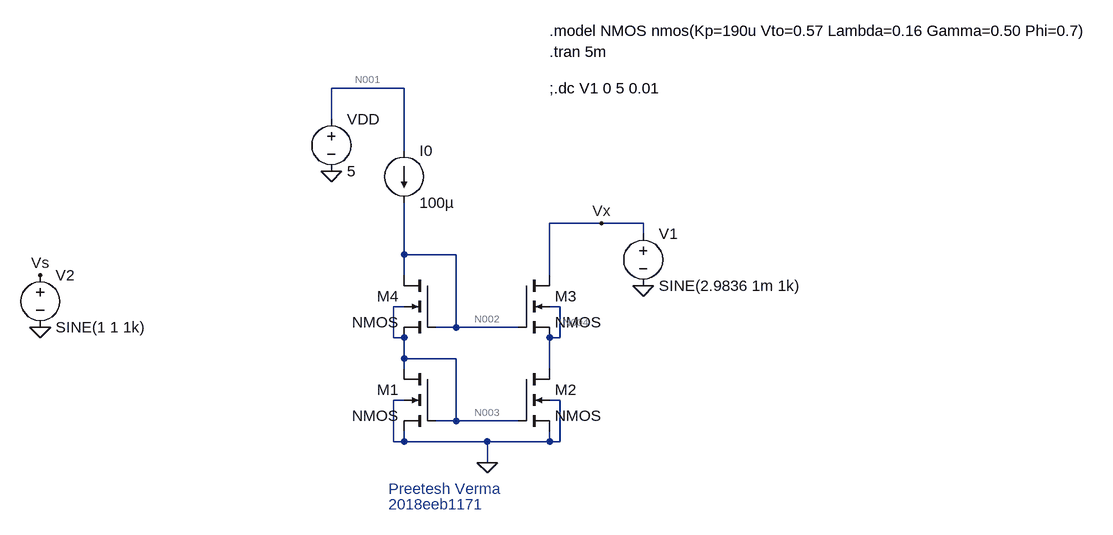
[diagram p0: schematic Cascode_current_source.asc]
Cascode_current_source.asc, the LTspice schematic file:
Version 4
SHEET 1 1192 680
WIRE 64 -528 -48 -528
WIRE -48 -480 -48 -528
WIRE 64 -432 64 -528
WIRE 368 -320 288 -320
WIRE 432 -320 368 -320
WIRE 432 -304 432 -320
WIRE 64 -272 64 -352
WIRE 144 -272 64 -272
WIRE 64 -240 64 -272
WIRE 288 -240 288 -320
WIRE 64 -192 48 -192
WIRE 304 -192 288 -192
WIRE 144 -160 144 -272
WIRE 144 -160 112 -160
WIRE 240 -160 144 -160
WIRE 48 -144 48 -192
WIRE 64 -144 48 -144
WIRE 304 -144 304 -192
WIRE 304 -144 288 -144
WIRE 64 -112 64 -144
WIRE 144 -112 64 -112
WIRE 64 -96 64 -112
WIRE 288 -96 288 -144
WIRE 64 -48 48 -48
WIRE 304 -48 288 -48
WIRE 144 -16 144 -112
WIRE 144 -16 112 -16
WIRE 240 -16 144 -16
WIRE 48 16 48 -48
WIRE 64 16 64 0
WIRE 64 16 48 16
WIRE 192 16 64 16
WIRE 288 16 288 0
WIRE 288 16 192 16
WIRE 304 16 304 -48
WIRE 304 16 288 16
WIRE 192 48 192 16
FLAG 192 48 0
FLAG -48 -400 0
FLAG 432 -224 0
FLAG 368 -320 Vx
FLAG -496 -160 0
FLAG -496 -240 Vs
SYMBOL nmos4 112 -96 M0
SYMATTR InstName M1
SYMBOL nmos4 240 -96 R0
SYMATTR InstName M2
SYMBOL nmos4 240 -240 R0
SYMATTR InstName M3
SYMBOL nmos4 112 -240 M0
SYMATTR InstName M4
SYMBOL voltage -48 -496 R0
SYMATTR InstName VDD
SYMATTR Value 5
SYMBOL voltage 432 -320 R0
WINDOW 123 0 0 Left 0
WINDOW 39 0 0 Left 0
SYMATTR InstName V1
SYMATTR Value SINE(2.9836 1m 1k)
SYMBOL current 64 -432 R0
WINDOW 123 0 0 Left 0
WINDOW 39 0 0 Left 0
SYMATTR InstName I0
SYMATTR Value 100µ
SYMBOL voltage -496 -256 R0
WINDOW 123 0 0 Left 0
WINDOW 39 0 0 Left 0
SYMATTR InstName V2
SYMATTR Value SINE(1 1 1k)
TEXT 288 -616 Left 2 !.model NMOS nmos(Kp=190u Vto=0.57 Lambda=0.16 Gamma=0.50 Phi=0.7)
TEXT 288 -584 Left 2 !.tran 5m
TEXT 40 88 Left 2 ;Preetesh Verma
TEXT 40 112 Left 2 ;2018eeb1171
TEXT 288 -528 Left 2 !;.dc V1 0 5 0.01

The netlist it stands for:
* Cascode_current_source.asc
M1 N003 N003 0 0 NMOS
M2 N004 N003 0 0 NMOS
M3 Vx N002 N004 N004 NMOS
M4 N002 N002 N003 N003 NMOS
VDD N001 0 5
V1 Vx 0 SINE(2.9836 1m 1k)
I0 N001 N002 100µ
V2 Vs 0 SINE(1 1 1k)
.model NMOS NMOS
.model PMOS PMOS
.lib standard.mos
.model NMOS nmos(Kp=190u Vto=0.57 Lambda=0.16 Gamma=0.50 Phi=0.7)
.tran 5m
* Preetesh Verma
* 2018eeb1171
;.dc V1 0 5 0.01
.backanno
.end

* Results of the author's LTspice run, read from the files saved beside the schematic
* Operating Point, zero values left out:
*   V(n003) = 1.492 V
*   V(n004) = 1.492 V
*   V(vx) = 2.984 V
*   V(n002) = 2.984 V
*   V(n001) = 5 V
*   V(vs) = 1 V
*   Id(M4) = 100 µA
*   Ib(M4) = -1.502 pA
*   Is(M4) = -100 µA
*   Id(M3) = 100 µA
*   Ib(M3) = -1.502 pA
*   Is(M3) = -100 µA
*   Id(M2) = 100 µA
*   Ib(M2) = -1.502 pA
*   Is(M2) = -100 µA
*   Id(M1) = 100 µA
*   Ib(M1) = -1.502 pA
*   Is(M1) = -100 µA
*   I(I0) = 100 µA
*   I(V1) = -100 µA
*   I(Vdd) = -100 µA
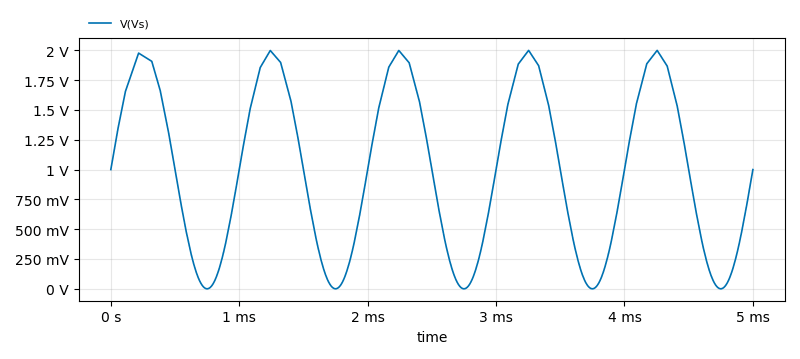
[diagram p1: Transient Analysis of Cascode_current_source.asc, plotted from the saved traces]
* Transient Analysis, 1 run:
*   V(Vs): min 3.751 µV, max 2 V, average 993.9 mV, rms 1.219 V, last 1 V